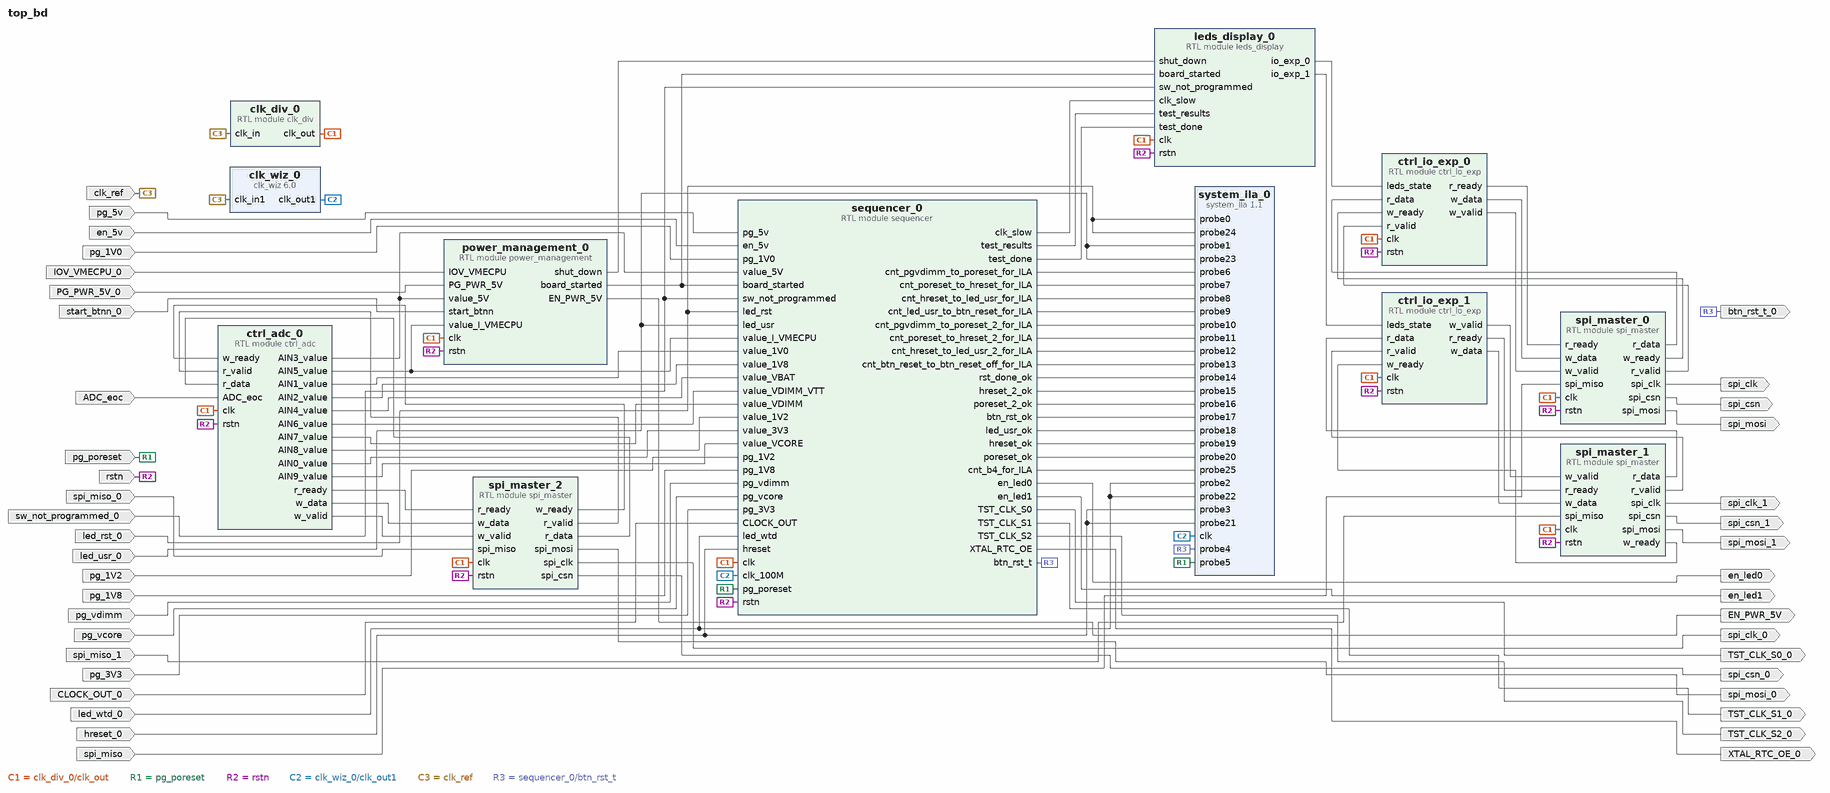
[diagram p0: block diagram of the top level]
# Vivado block design top_bd, xc7a200tfbg484-1, Vivado 2020.1
create_bd_design top_bd

create_bd_port -dir I spi_miso
create_bd_port -dir O spi_csn
create_bd_port -dir O -type clk spi_clk
create_bd_port -dir O spi_mosi
create_bd_port -dir O en_led0
create_bd_port -dir I -type clk clk_ref
set_property -dict {CONFIG.FREQ_HZ 20000000} [get_bd_ports clk_ref]
create_bd_port -dir O en_led1
create_bd_port -dir I spi_miso_1
create_bd_port -dir O spi_mosi_1
create_bd_port -dir O -type clk spi_clk_1
create_bd_port -dir O spi_csn_1
create_bd_port -dir I spi_miso_0
create_bd_port -dir O spi_mosi_0
create_bd_port -dir O -type clk spi_clk_0
create_bd_port -dir O spi_csn_0
create_bd_port -dir I pg_5v
create_bd_port -dir I en_5v
create_bd_port -dir I pg_1V0
create_bd_port -dir I pg_1V2
create_bd_port -dir I pg_1V8
create_bd_port -dir I pg_vdimm
create_bd_port -dir I pg_vcore
create_bd_port -dir I pg_3V3
create_bd_port -dir I pg_poreset
create_bd_port -dir O EN_PWR_5V
create_bd_port -dir I ADC_eoc
create_bd_port -dir I -type rst rstn
create_bd_port -dir I IOV_VMECPU_0
create_bd_port -dir I PG_PWR_5V_0
create_bd_port -dir I start_btnn_0
create_bd_port -dir I -type clk CLOCK_OUT_0
create_bd_port -dir O TST_CLK_S0_0
create_bd_port -dir O TST_CLK_S1_0
create_bd_port -dir O TST_CLK_S2_0
create_bd_port -dir I sw_not_programmed_0
create_bd_port -dir I -type rst led_rst_0
create_bd_port -dir I led_usr_0
create_bd_port -dir I led_wtd_0
create_bd_port -dir I hreset_0
create_bd_port -dir O btn_rst_t_0
create_bd_port -dir O XTAL_RTC_OE_0

create_bd_cell -type module -reference spi_master spi_master_0
set_property -dict {CONFIG.C_LENGTH 32} [get_bd_cells spi_master_0]
create_bd_cell -type module -reference spi_master spi_master_1
set_property -dict {CONFIG.C_LENGTH 32} [get_bd_cells spi_master_1]
create_bd_cell -type module -reference spi_master spi_master_2
set_property -dict {CONFIG.C_LENGTH 12} [get_bd_cells spi_master_2]
create_bd_cell -type ip -vlnv xilinx.com:ip:clk_wiz:6.0 clk_wiz_0
set_property -dict [list \
  CONFIG.CLKIN1_JITTER_PS 500.0 \
  CONFIG.CLKOUT1_JITTER 258.391 \
  CONFIG.CLKOUT1_PHASE_ERROR 301.005 \
  CONFIG.CLKOUT2_JITTER 349.551 \
  CONFIG.CLKOUT2_PHASE_ERROR 298.249 \
  CONFIG.CLKOUT2_REQUESTED_OUT_FREQ 32.75862 \
  CONFIG.CLKOUT2_USED false \
  CONFIG.CLKOUT3_JITTER 425.793 \
  CONFIG.CLKOUT3_PHASE_ERROR 298.249 \
  CONFIG.CLKOUT3_REQUESTED_OUT_FREQ 16.10169 \
  CONFIG.CLKOUT3_USED false \
  CONFIG.CLKOUT4_JITTER 387.125 \
  CONFIG.CLKOUT4_PHASE_ERROR 298.249 \
  CONFIG.CLKOUT4_REQUESTED_OUT_FREQ 25.000 \
  CONFIG.CLKOUT4_USED false \
  CONFIG.MMCM_CLKFBOUT_MULT_F 50.000 \
  CONFIG.MMCM_CLKIN1_PERIOD 50.000 \
  CONFIG.MMCM_CLKIN2_PERIOD 10.0 \
  CONFIG.MMCM_CLKOUT0_DIVIDE_F 10.000 \
  CONFIG.MMCM_CLKOUT1_DIVIDE 1 \
  CONFIG.MMCM_CLKOUT2_DIVIDE 1 \
  CONFIG.MMCM_CLKOUT3_DIVIDE 1 \
  CONFIG.NUM_OUT_CLKS 1 \
  CONFIG.PRIM_IN_FREQ 20.000 \
  CONFIG.USE_LOCKED false \
  CONFIG.USE_RESET false \
] [get_bd_cells clk_wiz_0]
create_bd_cell -type module -reference ctrl_io_exp ctrl_io_exp_0
create_bd_cell -type module -reference ctrl_io_exp ctrl_io_exp_1
set_property -dict {CONFIG.C_LENGTH_DATA 16 CONFIG.C_SLAVE_ADDR {"01000100"}} [get_bd_cells ctrl_io_exp_1]
create_bd_cell -type module -reference ctrl_adc ctrl_adc_0
create_bd_cell -type module -reference clk_div clk_div_0
set_property -dict {CONFIG.C_DIV 20} [get_bd_cells clk_div_0]
create_bd_cell -type ip -vlnv xilinx.com:ip:system_ila:1.1 system_ila_0
set_property -dict [list \
  CONFIG.C_MON_TYPE NATIVE \
  CONFIG.C_NUM_OF_PROBES 28 \
  CONFIG.C_PROBE10_WIDTH 65 \
  CONFIG.C_PROBE11_WIDTH 65 \
  CONFIG.C_PROBE12_WIDTH 65 \
  CONFIG.C_PROBE13_WIDTH 65 \
  CONFIG.C_PROBE25_WIDTH 65 \
  CONFIG.C_PROBE6_WIDTH 65 \
  CONFIG.C_PROBE7_WIDTH 65 \
  CONFIG.C_PROBE8_WIDTH 65 \
  CONFIG.C_PROBE9_WIDTH 65 \
  CONFIG.C_PROBE_WIDTH_PROPAGATION MANUAL \
] [get_bd_cells system_ila_0]
create_bd_cell -type module -reference leds_display leds_display_0
create_bd_cell -type module -reference power_management power_management_0
create_bd_cell -type module -reference sequencer sequencer_0

# ---- connections ----

connect_bd_net -net ctrl_io_exp_0_en_led0 [get_bd_pins sequencer_0/en_led0] [get_bd_ports en_led0]
connect_bd_net [get_bd_pins ctrl_io_exp_0/r_ready] [get_bd_pins spi_master_0/r_ready]
connect_bd_net [get_bd_pins ctrl_io_exp_0/w_data] [get_bd_pins spi_master_0/w_data]
connect_bd_net [get_bd_pins ctrl_io_exp_0/w_valid] [get_bd_pins spi_master_0/w_valid]
connect_bd_net [get_bd_pins spi_master_0/r_data] [get_bd_pins ctrl_io_exp_0/r_data]
connect_bd_net [get_bd_pins spi_master_0/w_ready] [get_bd_pins ctrl_io_exp_0/w_ready]
connect_bd_net [get_bd_pins spi_master_0/r_valid] [get_bd_pins ctrl_io_exp_0/r_valid]
connect_bd_net [get_bd_pins clk_div_0/clk_out] \
  [get_bd_pins spi_master_0/clk] [get_bd_pins spi_master_1/clk] [get_bd_pins spi_master_2/clk] \
  [get_bd_pins ctrl_io_exp_0/clk] [get_bd_pins ctrl_io_exp_1/clk] [get_bd_pins ctrl_adc_0/clk] \
  [get_bd_pins leds_display_0/clk] [get_bd_pins power_management_0/clk] [get_bd_pins sequencer_0/clk]
connect_bd_net [get_bd_pins ctrl_io_exp_1/w_valid] [get_bd_pins spi_master_1/w_valid]
connect_bd_net [get_bd_pins ctrl_io_exp_1/r_ready] [get_bd_pins spi_master_1/r_ready]
connect_bd_net [get_bd_pins ctrl_io_exp_1/w_data] [get_bd_pins spi_master_1/w_data]
connect_bd_net [get_bd_pins spi_master_1/r_data] [get_bd_pins ctrl_io_exp_1/r_data]
connect_bd_net [get_bd_pins spi_master_1/r_valid] [get_bd_pins ctrl_io_exp_1/r_valid]
connect_bd_net [get_bd_pins spi_master_1/w_ready] [get_bd_pins ctrl_io_exp_1/w_ready]
connect_bd_net -net ctrl_io_exp_0_en_led1 [get_bd_pins sequencer_0/en_led1] [get_bd_ports en_led1]
connect_bd_net -net spi_miso_0_1 [get_bd_ports spi_miso_1] [get_bd_pins spi_master_1/spi_miso]
connect_bd_net [get_bd_pins spi_master_1/spi_mosi] [get_bd_ports spi_mosi_1]
connect_bd_net [get_bd_pins spi_master_1/spi_clk] [get_bd_ports spi_clk_1]
connect_bd_net [get_bd_pins spi_master_1/spi_csn] [get_bd_ports spi_csn_1]
connect_bd_net [get_bd_pins spi_master_2/w_ready] [get_bd_pins ctrl_adc_0/w_ready]
connect_bd_net [get_bd_pins spi_master_2/r_valid] [get_bd_pins ctrl_adc_0/r_valid]
connect_bd_net [get_bd_pins spi_master_2/r_data] [get_bd_pins ctrl_adc_0/r_data]
connect_bd_net [get_bd_pins ctrl_adc_0/r_ready] [get_bd_pins spi_master_2/r_ready]
connect_bd_net [get_bd_pins ctrl_adc_0/w_data] [get_bd_pins spi_master_2/w_data]
connect_bd_net -net spi_miso_0_2 [get_bd_ports spi_miso_0] [get_bd_pins spi_master_2/spi_miso]
connect_bd_net [get_bd_pins spi_master_2/spi_mosi] [get_bd_ports spi_mosi_0]
connect_bd_net [get_bd_pins spi_master_2/spi_clk] [get_bd_ports spi_clk_0]
connect_bd_net [get_bd_pins spi_master_2/spi_csn] [get_bd_ports spi_csn_0]
connect_bd_net -net pg_5v_0_1 [get_bd_ports pg_5v] [get_bd_pins sequencer_0/pg_5v]
connect_bd_net -net en_5v_0_1 [get_bd_ports en_5v] [get_bd_pins sequencer_0/en_5v]
connect_bd_net -net pg_1V0_0_1 [get_bd_ports pg_1V0] [get_bd_pins sequencer_0/pg_1V0]
connect_bd_net -net pg_1V2_0_1 [get_bd_ports pg_1V2] [get_bd_pins sequencer_0/pg_1V2]
connect_bd_net -net pg_1V8_0_1 [get_bd_ports pg_1V8] [get_bd_pins sequencer_0/pg_1V8]
connect_bd_net -net pg_vdimm_0_1 [get_bd_ports pg_vdimm] [get_bd_pins sequencer_0/pg_vdimm]
connect_bd_net -net pg_vcore_0_1 [get_bd_ports pg_vcore] [get_bd_pins sequencer_0/pg_vcore]
connect_bd_net -net pg_3V3_0_1 [get_bd_ports pg_3V3] [get_bd_pins sequencer_0/pg_3V3]
connect_bd_net -net pg_poreset_0_1 [get_bd_ports pg_poreset] [get_bd_pins system_ila_0/probe5] [get_bd_pins sequencer_0/pg_poreset]
connect_bd_net [get_bd_pins ctrl_adc_0/AIN1_value] [get_bd_pins sequencer_0/value_1V0]
connect_bd_net [get_bd_pins ctrl_adc_0/AIN2_value] [get_bd_pins sequencer_0/value_1V8]
connect_bd_net [get_bd_pins ctrl_adc_0/AIN3_value] [get_bd_pins power_management_0/value_5V] [get_bd_pins sequencer_0/value_5V]
connect_bd_net [get_bd_pins ctrl_adc_0/AIN4_value] [get_bd_pins sequencer_0/value_VBAT]
connect_bd_net [get_bd_pins ctrl_adc_0/AIN6_value] [get_bd_pins sequencer_0/value_VDIMM_VTT]
connect_bd_net [get_bd_pins ctrl_adc_0/AIN7_value] [get_bd_pins sequencer_0/value_VDIMM]
connect_bd_net [get_bd_pins ctrl_adc_0/AIN8_value] [get_bd_pins sequencer_0/value_1V2]
connect_bd_net [get_bd_pins ctrl_adc_0/w_valid] [get_bd_pins spi_master_2/w_valid]
connect_bd_net [get_bd_pins sequencer_0/clk_slow] [get_bd_pins leds_display_0/clk_slow]
connect_bd_net [get_bd_pins sequencer_0/test_results] [get_bd_pins leds_display_0/test_results]
connect_bd_net [get_bd_pins sequencer_0/test_done] [get_bd_pins leds_display_0/test_done]
connect_bd_net [get_bd_pins power_management_0/board_started] [get_bd_pins leds_display_0/board_started] [get_bd_pins sequencer_0/board_started]
connect_bd_net [get_bd_pins power_management_0/EN_PWR_5V] [get_bd_ports EN_PWR_5V]
connect_bd_net [get_bd_pins leds_display_0/io_exp_0] [get_bd_pins ctrl_io_exp_0/leds_state]
connect_bd_net [get_bd_pins leds_display_0/io_exp_1] [get_bd_pins ctrl_io_exp_1/leds_state]
connect_bd_net -net ADC_eoc_0_1 [get_bd_ports ADC_eoc] [get_bd_pins ctrl_adc_0/ADC_eoc]
connect_bd_net [get_bd_pins ctrl_adc_0/AIN0_value] [get_bd_pins sequencer_0/value_3V3]
connect_bd_net [get_bd_ports spi_miso] [get_bd_pins spi_master_0/spi_miso]
connect_bd_net [get_bd_pins spi_master_0/spi_mosi] [get_bd_ports spi_mosi]
connect_bd_net [get_bd_pins spi_master_0/spi_clk] [get_bd_ports spi_clk]
connect_bd_net [get_bd_pins spi_master_0/spi_csn] [get_bd_ports spi_csn]
connect_bd_net -net rstn_0_1 [get_bd_ports rstn] \
  [get_bd_pins spi_master_0/rstn] [get_bd_pins spi_master_1/rstn] [get_bd_pins spi_master_2/rstn] \
  [get_bd_pins ctrl_io_exp_0/rstn] [get_bd_pins ctrl_io_exp_1/rstn] [get_bd_pins ctrl_adc_0/rstn] \
  [get_bd_pins leds_display_0/rstn] [get_bd_pins power_management_0/rstn] [get_bd_pins sequencer_0/rstn]
connect_bd_net [get_bd_pins ctrl_adc_0/AIN5_value] [get_bd_pins power_management_0/value_I_VMECPU] [get_bd_pins sequencer_0/value_I_VMECPU]
connect_bd_net [get_bd_pins ctrl_adc_0/AIN9_value] [get_bd_pins sequencer_0/value_VCORE]
connect_bd_net -net IOV_VMECPU_0_1 [get_bd_ports IOV_VMECPU_0] [get_bd_pins power_management_0/IOV_VMECPU]
connect_bd_net -net PG_PWR_5V_0_1 [get_bd_ports PG_PWR_5V_0] [get_bd_pins power_management_0/PG_PWR_5V]
connect_bd_net -net start_btnn_0_1 [get_bd_ports start_btnn_0] [get_bd_pins power_management_0/start_btnn]
connect_bd_net -net CLOCK_OUT_0_1 [get_bd_ports CLOCK_OUT_0] [get_bd_pins sequencer_0/CLOCK_OUT]
connect_bd_net [get_bd_pins sequencer_0/TST_CLK_S0] [get_bd_ports TST_CLK_S0_0]
connect_bd_net [get_bd_pins sequencer_0/TST_CLK_S1] [get_bd_ports TST_CLK_S1_0]
connect_bd_net [get_bd_pins sequencer_0/TST_CLK_S2] [get_bd_ports TST_CLK_S2_0]
connect_bd_net [get_bd_pins clk_wiz_0/clk_out1] [get_bd_pins system_ila_0/clk] [get_bd_pins sequencer_0/clk_100M]
connect_bd_net [get_bd_ports clk_ref] [get_bd_pins clk_wiz_0/clk_in1] [get_bd_pins clk_div_0/clk_in]
connect_bd_net [get_bd_pins power_management_0/shut_down] [get_bd_pins leds_display_0/shut_down]
connect_bd_net -net sw_not_programmed_0_1 [get_bd_ports sw_not_programmed_0] \
  [get_bd_pins leds_display_0/sw_not_programmed] [get_bd_pins sequencer_0/sw_not_programmed]
connect_bd_net -net led_rst_0_1 [get_bd_ports led_rst_0] \
  [get_bd_pins system_ila_0/probe0] [get_bd_pins system_ila_0/probe24] [get_bd_pins sequencer_0/led_rst]
connect_bd_net -net led_usr_0_1 [get_bd_ports led_usr_0] \
  [get_bd_pins system_ila_0/probe1] [get_bd_pins system_ila_0/probe23] [get_bd_pins sequencer_0/led_usr]
connect_bd_net -net led_wtd_0_1 [get_bd_ports led_wtd_0] \
  [get_bd_pins system_ila_0/probe2] [get_bd_pins system_ila_0/probe22] [get_bd_pins sequencer_0/led_wtd]
connect_bd_net -net hreset_0_1 [get_bd_ports hreset_0] \
  [get_bd_pins system_ila_0/probe3] [get_bd_pins system_ila_0/probe21] [get_bd_pins sequencer_0/hreset]
connect_bd_net [get_bd_pins sequencer_0/btn_rst_t] [get_bd_ports btn_rst_t_0] [get_bd_pins system_ila_0/probe4]
connect_bd_net [get_bd_pins sequencer_0/cnt_pgvdimm_to_poreset_for_ILA] [get_bd_pins system_ila_0/probe6]
connect_bd_net [get_bd_pins sequencer_0/cnt_poreset_to_hreset_for_ILA] [get_bd_pins system_ila_0/probe7]
connect_bd_net [get_bd_pins sequencer_0/cnt_hreset_to_led_usr_for_ILA] [get_bd_pins system_ila_0/probe8]
connect_bd_net [get_bd_pins sequencer_0/cnt_led_usr_to_btn_reset_for_ILA] [get_bd_pins system_ila_0/probe9]
connect_bd_net [get_bd_pins sequencer_0/cnt_pgvdimm_to_poreset_2_for_ILA] [get_bd_pins system_ila_0/probe10]
connect_bd_net [get_bd_pins sequencer_0/cnt_poreset_to_hreset_2_for_ILA] [get_bd_pins system_ila_0/probe11]
connect_bd_net [get_bd_pins sequencer_0/cnt_hreset_to_led_usr_2_for_ILA] [get_bd_pins system_ila_0/probe12]
connect_bd_net [get_bd_pins sequencer_0/cnt_btn_reset_to_btn_reset_off_for_ILA] [get_bd_pins system_ila_0/probe13]
connect_bd_net [get_bd_pins sequencer_0/XTAL_RTC_OE] [get_bd_ports XTAL_RTC_OE_0]
connect_bd_net [get_bd_pins sequencer_0/rst_done_ok] [get_bd_pins system_ila_0/probe14]
connect_bd_net [get_bd_pins sequencer_0/hreset_2_ok] [get_bd_pins system_ila_0/probe15]
connect_bd_net [get_bd_pins sequencer_0/poreset_2_ok] [get_bd_pins system_ila_0/probe16]
connect_bd_net [get_bd_pins sequencer_0/btn_rst_ok] [get_bd_pins system_ila_0/probe17]
connect_bd_net [get_bd_pins sequencer_0/led_usr_ok] [get_bd_pins system_ila_0/probe18]
connect_bd_net [get_bd_pins sequencer_0/hreset_ok] [get_bd_pins system_ila_0/probe19]
connect_bd_net [get_bd_pins sequencer_0/poreset_ok] [get_bd_pins system_ila_0/probe20]
connect_bd_net [get_bd_pins sequencer_0/cnt_b4_for_ILA] [get_bd_pins system_ila_0/probe25]

validate_bd_design
save_bd_design
